# EAGLE design little2wire (EAGLE 7.2.0)
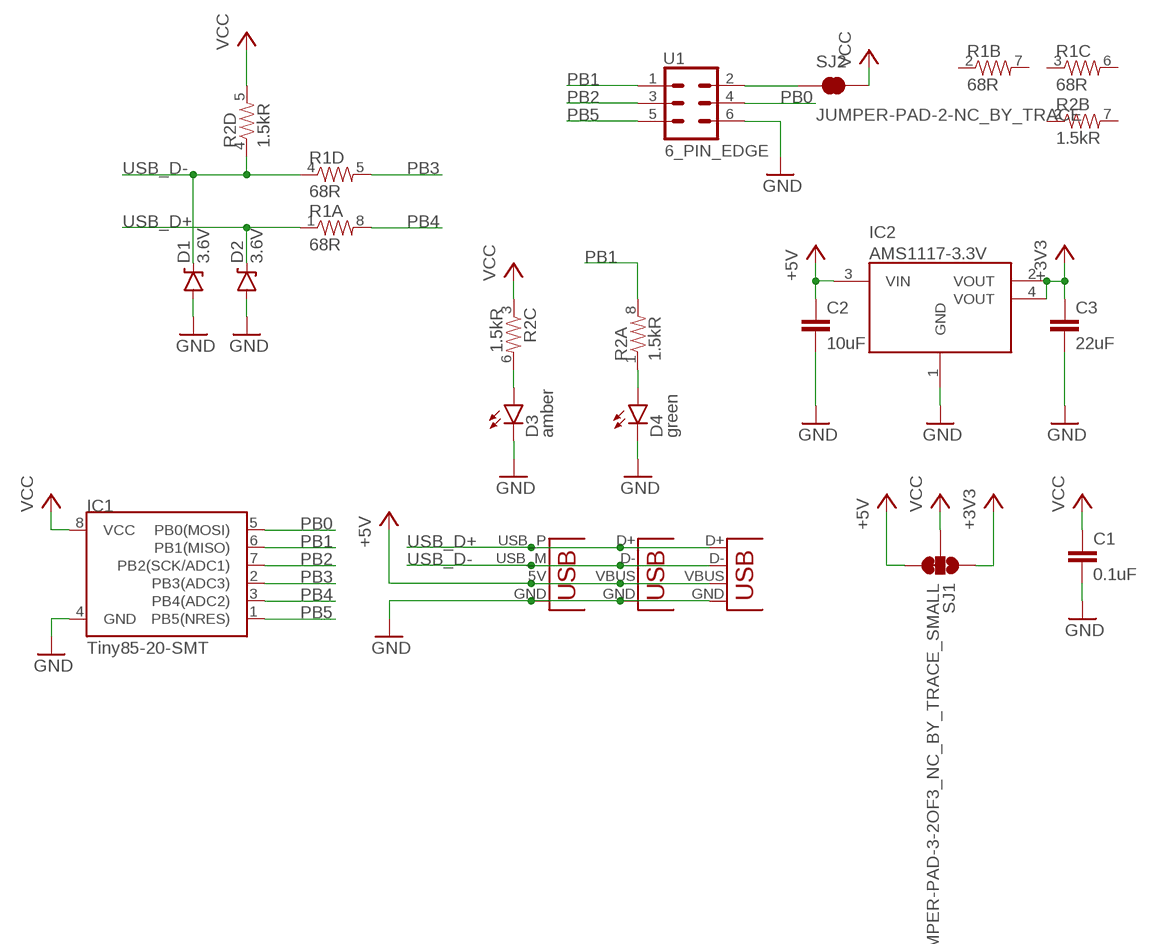
[diagram p0: schematic, sheet 1]

## Parts
C1  0.1uF  CAPACITOR0805  [0805]
C2  10uF  CAPACITOR0805  [0805]
C3  22uF  CAPACITOR0805  [0805]
D1  3.6V  DIODE-ZENER_SOD323  [SOD-323]
D2  3.6V  DIODE-ZENER_SOD323  [SOD-323]
D3  amber  LED805  [LED-805]
D4  green  LED805  [LED-805]
IC1  Tiny85-20-SMT  ATTINY45TINY85-20-SMT  [SO08-EIAJ]
IC2  AMS1117-3.3V  AMS1117_SOT223  [SOT223]
JP1  USBPCB  [USB-A-PCB]
JP2  USBSMD  [USB-MINIB]
JP3  USB-MICROB  [USB-MICROB]
R1  68R  RESISTOR-ARRAY1206ARR  [1206-ARRAY]
R2  1.5kR  RESISTOR-ARRAY1206ARR  [1206-ARRAY]
SJ1  JUMPER-PAD-3-2OF3_NC_BY_TRACE_SMALL  [PAD-JUMPER-3-2OF3_NC_BY_TRACE_YES_SILK_FULL_BOX]
SJ2  JUMPER-PAD-2-NC_BY_TRACE  [PAD-JUMPER-2-NC_BY_TRACE_YES_SILK]
U1  6_PIN_EDGE  [6_PIN_EDGE]

## Nets
+3V3: C3.1 IC2.2(VOUT) IC2.4(VOUT) SJ1.1
+5V: C2.1 IC2.3(VIN) JP1.5V(VBUS) JP2.VBUS JP3.VBUS SJ1.3
GND: C1.2 C2.2 C3.2 D1.A D2.A D3.C D4.C IC1.4(GND) IC2.1(GND) JP1.GND JP2.GND JP3.GND U1.6
N$1: D4.A R2.1
N$2: D3.A R2.6
N$3: SJ2.1 U1.2
PB0: IC1.5(PB0(MOSI)) U1.4
PB1: IC1.6(PB1(MISO)) R2.8 U1.1
PB2: IC1.7(PB2(SCK/ADC1)) U1.3
PB3: IC1.2(PB3(ADC3)) R1.5
PB4: IC1.3(PB4(ADC2)) R1.8
PB5: IC1.1(PB5(NRES)) U1.5
USB_D+: D2.C JP1.USB_P(D+) JP2.D+ JP3.D+ R1.1
USB_D-: D1.C JP1.USB_M(D-) JP2.D- JP3.D- R1.4 R2.4
VCC: C1.1 IC1.8(VCC) R2.3 R2.5 SJ1.2 SJ2.2
Unconnected: R1.2 R1.3 R1.6 R1.7 R2.2 R2.7

## Library data of the parts
C1-C3 = flabbergast:CAPACITOR
D1 D2 = flabbergast:DIODE-ZENER
D3 D4 = flabbergast:LED: Blue LEDs for production use Various blue LEDs stocked by SparkFun production 0603 - DIO-08575 Rebel - DIO-09553 1206 - DIO-09911
IC1 = flabbergast:ATTINY45: Atmel 8-pin 2/4/8kB flash uC; PROD_ID: IC-09092
IC2 = flabbergast:AMS1117
JP1 = flabbergast:USB: USB Connectors USB-B-PTH is fully proven SKU : PRT-00139/CONN-08278 USB-miniB is fully proven SKU : PRT-00587 USB-A-PCB is untested. USB-A-H is throughly reviewed, but untested. Spark Fun Electronics SKU : PRT-00437 USB-B-SMT is throughly reviewed, but untested. Needs silkscreen touching up. USB-A-S has not been used/tested USB-MB-H has not been used/tested USB-MICROB has been used. CONN-09505
JP2 = flabbergast:USB: USB Connectors USB-B-PTH is fully proven SKU : PRT-00139/CONN-08278 USB-miniB is fully proven SKU : PRT-00587 USB-A-PCB is untested. USB-A-H is throughly reviewed, but untested. Spark Fun Electronics SKU : PRT-00437 USB-B-SMT is throughly reviewed, but untested. Needs silkscreen touching up. USB-A-S has not been used/tested USB-MB-H has not been used/tested USB-MICROB has been used. CONN-09505; PROD_ID: CONN-08193
JP3 = flabbergast:USB: USB Connectors USB-B-PTH is fully proven SKU : PRT-00139/CONN-08278 USB-miniB is fully proven SKU : PRT-00587 USB-A-PCB is untested. USB-A-H is throughly reviewed, but untested. Spark Fun Electronics SKU : PRT-00437 USB-B-SMT is throughly reviewed, but untested. Needs silkscreen touching up. USB-A-S has not been used/tested USB-MB-H has not been used/tested USB-MICROB has been used. CONN-09505; PROD_ID: CONN-09505
R1 R2 = flabbergast:RESISTOR-ARRAY: Array Chip Resistor Source: RS Component / Phycomp
SJ1 = SparkFun-Passives:JUMPER-PAD-3-2OF3_NC_BY_TRACE
SJ2 = SparkFun-Passives:JUMPER-PAD-2-NC_BY_TRACE
U1 = flabbergast:6_PIN_EDGE

## Board
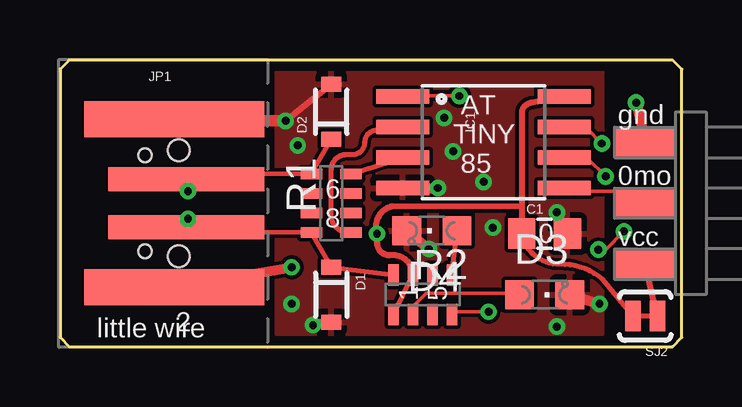
[diagram p1: board, top side]
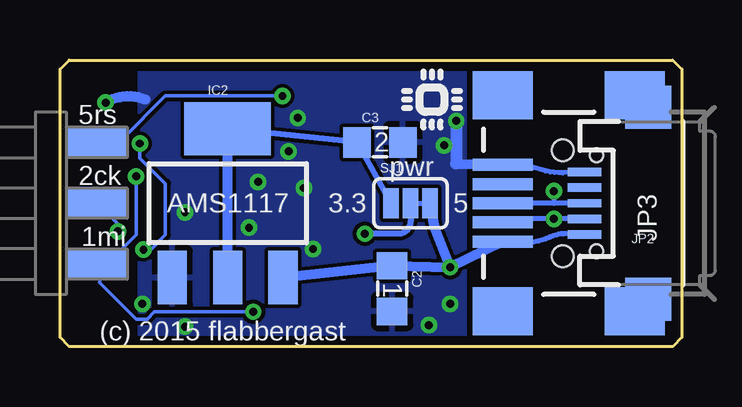
[diagram p2: board, bottom side, seen from below]

Size 25.91 x 11.94 mm. Coordinates in mm from the lower left corner, seen from the top.
Outline: 0,0.38 0.38,0 25.53,0 25.91,0.38 25.91,11.56 25.53,11.94 0.38,11.94 0,11.56 0,0.38
Copper layers (1*16): Top 0.0356mm / dielectric 1.5011mm / Bottom 0.0356mm
Design rules "LaenPCBOrder *": minimum track width 6mil, minimum drill 13mil, track to track 6mil, track to pad 6mil, pad to pad 6mil, via to via 6mil, smd to smd 0mil, copper to edge 15mil, drill to drill 6mil, minimum pad ring 7mil, minimum via ring 7mil, stop-mask expansion 3mil, vias tented up to drill 30mil, thermal gap 10mil

### Footprints (pad centres in the part's own frame; a part is rotated, then mirrored left to right if it is on the bottom)
0805 = smd 1.143 x 1.27: 1 -0.953,0; 2 0.953,0
SOD-323 = smd 0.63 x 0.83: A 1.15,0; C -1.15,0
LED-805 = smd 1.2 x 1.2: A 0,-1.05; C 0,1.05
SO08-EIAJ = smd 0.61 x 2.21: 1 -1.905,-3.378; 2 -0.635,-3.378; 3 0.635,-3.378; 4 1.905,-3.378; 5 1.905,3.353; 6 0.635,3.353; 7 -0.635,3.353; 8 -1.905,3.353
SOT223 = smd 1.219 x 2.235: 1 -2.311,-3.099; 2 0,-3.099; 3 2.311,-3.099 | smd 3.6 x 2.2: 4 0,3.099
USB-A-PCB = smd 7.5 x 1.5: 5V -0.2,-3.5; GND -0.2,3.5 | smd 6.5 x 1: USB_M 0.3,-1; USB_P 0.3,1
USB-MINIB = smd 2.5 x 0.5: D+ 2.5,0; D- 2.5,0.8; GND 2.5,-1.6; ID 2.5,-0.8; VBUS 2.5,1.6 | smd 2.5 x 2: MTN1 -3,4.5; MTN2 2.5,4.5; MTN3 -3,-4.5; MTN4 2.5,-4.5 | hole 0.9: 0,2.2; 0,-2.2
USB-MICROB = smd 0.35 x 1.4: D+ 0,2.65; D- -0.65,2.65; GND 1.3,2.65; ID 0.65,2.65; VBUS -1.3,2.65 | smd 1.8 x 1.9: MT1 -4,0; MT2 4,0 | hole 0.55: -2,2.15; 2,2.15
1206-ARRAY = smd 0.452 x 0.889: 1 -1.219,-0.826; 2 -0.406,-0.826; 3 0.406,-0.826; 4 1.219,-0.826; 5 1.219,0.826; 6 0.406,0.826; 7 -0.406,0.826; 8 -1.219,0.826
PAD-JUMPER-3-2OF3_NC_BY_TRACE_YES_SILK_FULL_BOX = smd 0.635 x 1.27: 1 -0.813,0; 2 0,0; 3 0.813,0
PAD-JUMPER-2-NC_BY_TRACE_YES_SILK = smd 0.635 x 1.27: 1 -0.508,0; 2 0.508,0
6_PIN_EDGE = smd 1.27 x 2.54: 1 2.54,1.27; 3 0,1.27; 5 -2.54,1.27 | smd 1.27 x 2.54 bottom: 2 2.54,1.27; 4 0,1.27; 6 -2.54,1.27

### Placement (x,y rotation side)
C1  20.19,4.7 0 top
C2  12.06,2.41 270 bottom
C3  12.57,8.51 0 bottom
D1  11.3,2.16 270 top
D2  11.3,9.78 90 top
D3  20.19,2.16 270 top
D4  15.49,4.83 90 top
IC1  17.65,8.51 270 top
IC2  18.92,5.97 0 bottom
JP1  4.95,5.97 0 top
JP2  4.95,5.97 180 bottom
JP3  1.4,5.97 90 bottom
R1  11.3,5.97 270 top
R2  15.11,2.16 180 top
SJ1  11.3,5.97 0 bottom
SJ2  24.38,1.27 180 top
U1  25.65,5.97 270 bottom
U$1  [IC_TINY]  10.41,10.29 0 bottom

### Tracks (layer width: path | path; a pad name or v marks a point on that pad's centre or on a via)
+3V3
  Bottom 0.254: SJ1.1 C3.1 IC2.4
  Bottom 0.406: IC2.2 IC2.4
+5V  (via drill 0.33)
  Top 0.406: JP1.5V v9.65,3.3
  Bottom 0.203: JP3.VBUS 4.83,4.7 arc-26 5.46,4.57 arc37 JP2.VBUS
  Bottom 0.406: v9.65,3.3 10.29,4.95 SJ1.3 | IC2.3 C2.1 v9.65,3.3 | JP2.VBUS v9.65,3.3
GND  (via drill 0.33)
  Top 0.254: v9.4,9.4 D2.A
  Top 0.406: D1.A v10.54,0.89 | D4.C v15.37,4.06 | IC1.4 v15.75,6.6 | D3.C v22.48,1.78 | C1.2 v20.7,5.59 | v24,10.16 U1.6
  Top 0.508: JP1.GND v9.4,9.4
  Bottom 0.203: JP3.GND 4.95,7.24 arc19 5.84,7.37 arc-21 JP2.GND
  Bottom 0.406: 9.4,7.62 JP2.GND | v24,10.16 arc56 22.35,10.29
  Bottom 0.508: v9.4,9.4 9.4,7.62
  other vias: 9.91,8.38 9.65,1.78 17.65,6.86 16.38,8.13 16,9.52 20.7,0.83 18.03,4.95
  pour Bottom: 9.02,11.68 22.61,11.68 22.61,0.25 9.02,0.25
  pour Top: 9.02,11.43 22.61,11.43 22.61,0.51 9.02,0.51
N$1
  Top 0.203: R2.1 D4.A
N$2
  Top 0.152: R2.6 14.81,1.6 14.81,1.75 15.27,2.21 19.07,2.21 D3.A
N$3
  Top 0.254: SJ2.1 U1.2
PB0
  Top 0.152: IC1.5 21.06,6.48 23.8,6.48 24.26,6.02 U1.4
PB1  (via drill 0.33)
  Top 0.152: v17.86,1.45 16.33,1.45 R2.8 | v22.73,7.09 21.97,7.85 21.06,7.85 IC1.6
  Bottom 0.152: v17.86,1.45 21.97,1.45 22.28,1.14 22.73,1.14 24.26,2.67 24.26,3.12 | 24.26,3.12 24.26,3.43 U1.1 24.26,3.12 | v22.73,7.09 22.73,4.65 24.26,3.12
PB2  (via drill 0.33)
  Top 0.152: v22.58,8.46 21.97,9.07 21.06,9.07 IC1.7 | v22.43,4.04 22.73,4.04 v23.49,4.8
  Bottom 0.152: v22.58,8.46 22.58,7.85 21.51,6.78 21.51,4.65 22.12,4.04 v22.43,4.04 | v23.49,4.8 23.49,5.1 24.26,5.87 U1.3
PB3
  Top 0.203: R1.5 arc-90 11.3,5.39 11.3,7.37 arc-90 11.94,8 12.19,8 arc90 12.7,8.51 arc-90 13.21,9.02 14.15,9.02 arc90 IC1.2
PB4
  Top 0.203: R1.8 IC1.3
PB5  (via drill 0.33)
  Top 0.152: v16.64,10.44 14.35,10.44 IC1.1
  Bottom 0.152: v16.64,10.44 21.51,10.44 23.34,8.61 24.26,8.61 U1.5
USB_D+  (via drill 0.33)
  Top 0.203: JP1.USB_P 5.33,6.97 v5.33,6.48 5.33,7.17 R1.1 D2.C
  Bottom 0.203: JP3.D+ 5.33,5.97 | 5.33,5.97 JP2.D+ | v5.33,6.48 5.33,5.97
USB_D-  (via drill 0.33)
  Top 0.203: v5.33,5.32 5.33,4.97 JP1.USB_M 5.25,4.77 R1.4 D1.C R2.4
  Bottom 0.203: JP3.D- v5.33,5.32 7.45,5.32 JP2.D-
VCC  (via drill 0.33)
  Top 0.203: SJ2.2 22.61,2.79 arc43 20.83,3.43 arc-81 C1.1 | R2.5 R2.3
  Top 0.254: R2.3 arc98 13.72,3.81 arc-90 13.21,4.32 v13.21,4.7 arc-97 13.84,5.84 19.24,5.83 | IC1.8 19.68,10.16 arc90 19.24,9.71 19.24,5.83 | 19.24,5.83 C1.1
  Bottom 0.254: SJ1.2 11.3,5.21 arc90 11.81,4.7 v13.21,4.7

### Text on the board
tPlace: gnd | AT / TINY / 85 | 0mo | 6 / 8 | 0 | vcc | 1 / 5 | little wire | 2
bPlace: 5rs | 2 | pwr | 2ck | 5 | 3.3 | AMS1117 | 1mi | 1 | (c) 2015 flabbergast